# EAGLE schematic source_eagle (EAGLE 9.6.2)
COMPANY: ADAFRUIT INDUSTRIES; DRAWN: KTOWN; REV: A
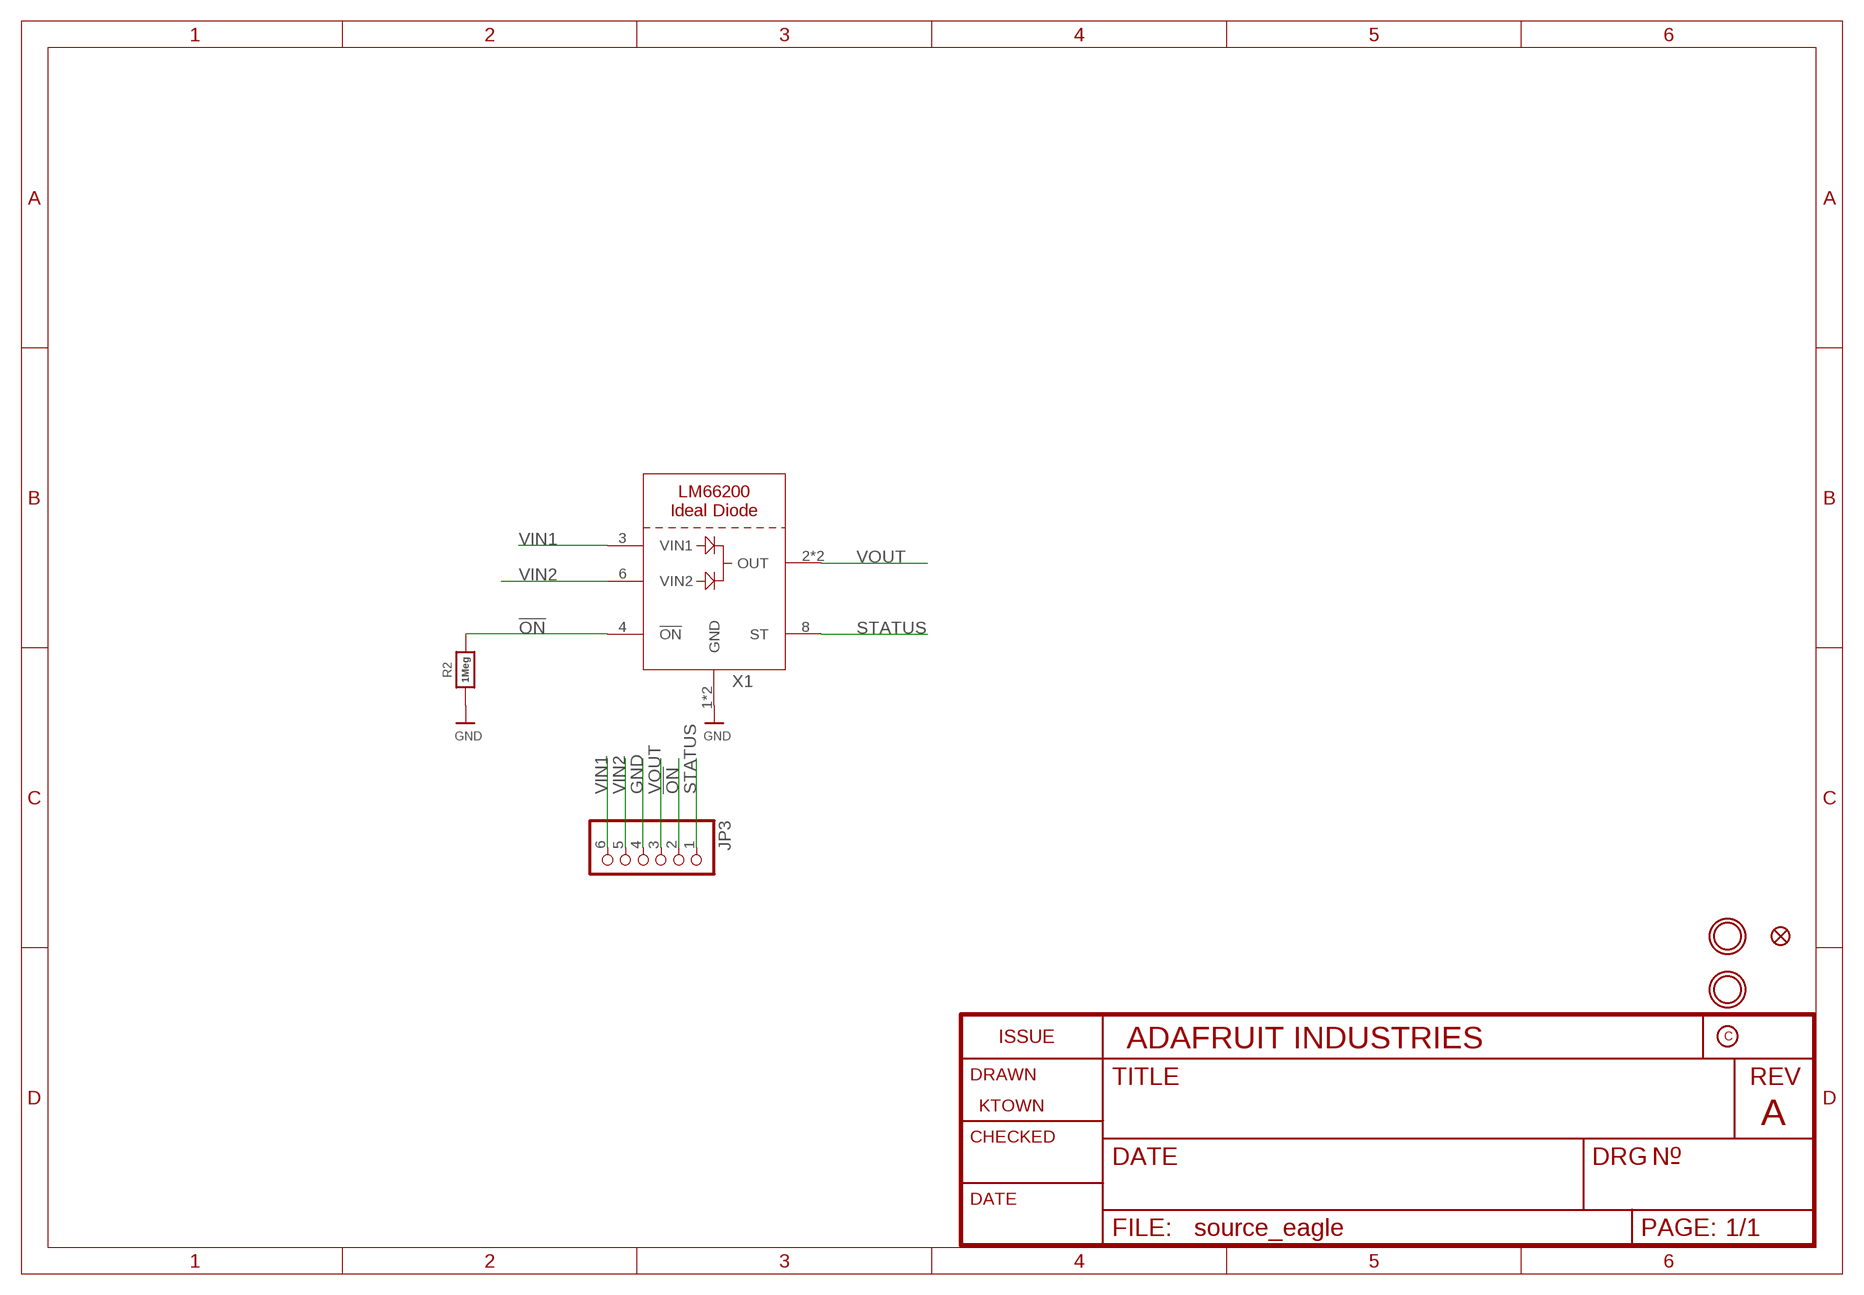
[diagram p0: schematic, sheet 1]

## Parts
FID2  FIDUCIAL_1MM  [FIDUCIAL_1MM]
JP3  HEADER-1X670MIL  [1X06_ROUND_70]
R2  1Meg  RESISTOR_0603_NOOUT  [0603-NO]
U$1  MOUNTINGHOLE2.5  [MOUNTINGHOLE_2.5_PLATED]
U$9  MOUNTINGHOLE2.5  [MOUNTINGHOLE_2.5_PLATED]
X1  LM66200  [SOT583]

## Nets
!ON: JP3.2 R2.2 X1.4(!ON)
GND: JP3.4 R2.1 X1.1(GND) X1.5(GND)
STATUS: JP3.1 X1.8(ST)
VIN1: JP3.6 X1.3(VIN1)
VIN2: JP3.5 X1.6(VIN2)
VOUT: JP3.3 X1.2(OUT) X1.7(OUT)

## Library data of the parts
FID2 = microbuilder:FIDUCIAL: Fiducial Alignment Points Various fiducial points for machine vision alignment.; BOM: EXCLUDE
JP3 = microbuilder:HEADER-1X6: PIN HEADER
R2 = microbuilder:RESISTOR: Resistors For new designs, use the packages preceded by an '_' character since they are more reliable: The following footprints should be used on most boards: _0402 - Standard footprint for regular board layouts _0603 - Standard footprint for regular board layouts _0805 - Standard footprint for regular board layouts _1206 - Standard footprint for regular board layouts For extremely tight-pitch boards where space is at a premium, the following 'micro-pitch' footprints can be used (smaller pads, no silkscreen outline, etc.): _0402MP - Micro-pitch footprint for very dense/compact boards _0603MP - Micro-pitch footprint for very dense/compact boards _0805MP - Micro-pitch footprint for very dense/compact boards _1206MP - Micro-pitch footprint for very dense/compact boards
U$1 U$9 = adafruit_electromech:MOUNTINGHOLE: Mounting Hole For #2 screws (0.086"/2.18mm width, 0.094"/2.4mm hole) use 2.5mm; BOM: EXCLUDE
X1 = adafruit_power:LM66200